# EasyEDA schematic 1-Schematic_task10.1_PCB.json
TITLE: Sheet_1; REV: 1.0; Date: 2021-05-09; Sheet: 1/1; Drawn By: nawaf329; Company: Your Company
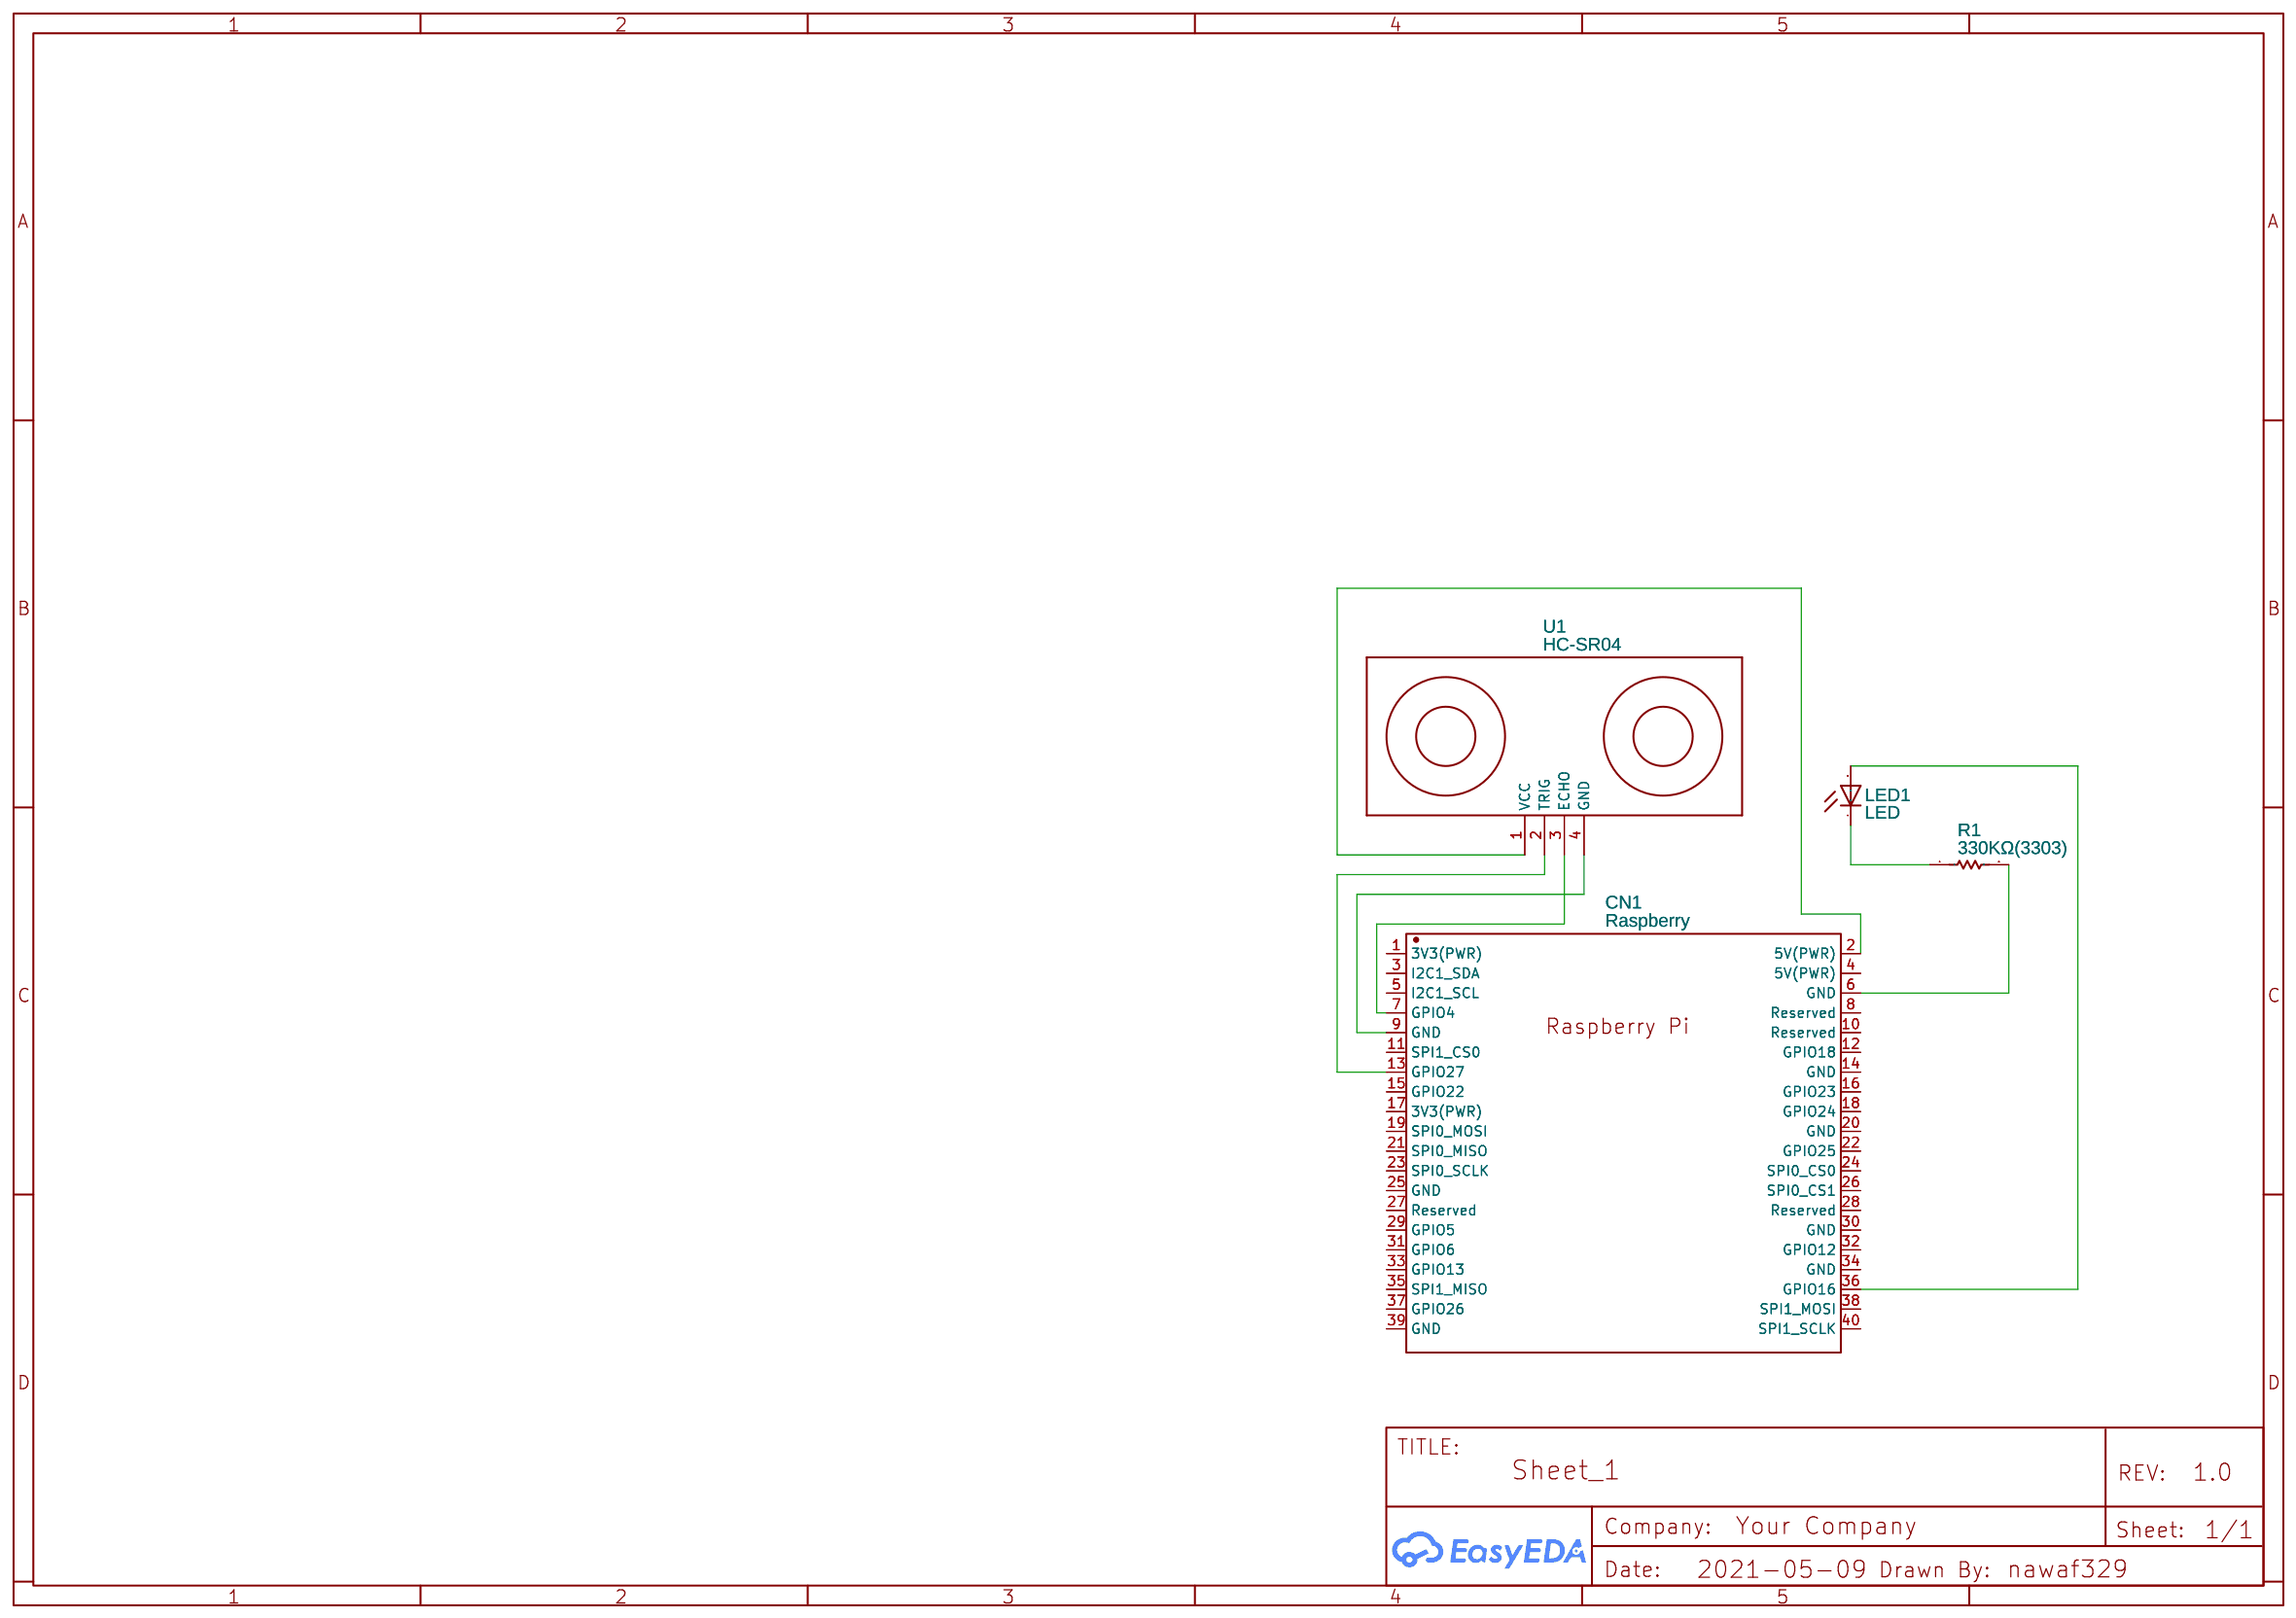
[diagram p0: schematic sheet]

## Parts
CN1  Raspberry  [HDR2X20-REVERSED]
LED1  LED  [LED-5MM-90DEG]
R1  330KΩ(3303)  [0201]
U1  HC-SR04  [HC-SR04]

## Library data of the parts
CN1 = Raspberry Pi 2: Contributor: Jason+Pierce; sourceId: gQK2WevN5
LED1 = LED: Contributor: DangerousPrototype
R1 = 330KΩ(3303): Supplier Part: undefined; Supplier: LCSC; Manufacturer: RTT013303FTH; Manufacturer Part: RALEC
U1 = HC-SR04: Ultrasonic Ranging Module HC-SR04; Contributor: h6000p

## Nets
Net-(CN1-2): CN1.2(5V(PWR)) U1.1(VCC)
Net-(CN1-6): CN1.6(GND) R1.2
Net-(CN1-7): CN1.7(GPIO4) U1.3(ECHO)
Net-(CN1-9): CN1.9(GND) U1.4(GND)
Net-(CN1-13): CN1.13(GPIO27) U1.2(TRIG)
Net-(CN1-36): CN1.36(GPIO16) LED1.A
Net-(LED1-K): LED1.K(C) R1.1

Not connected (* = marked no-connect by the designer): CN1 1(3V3(PWR)) 3(I2C1 SDA) 4(5V(PWR)) 5(I2C1 SCL) 8(Reserved) 10(Reserved) 11(SPI1 CS0) 12(GPIO18) 14(GND) 15(GPIO22) 16(GPIO23) 17(3V3(PWR)) 18(GPIO24) 19(SPI0 MOSI) 20(GND) 21(SPI0 MISO) 22(GPIO25) 23(SPI0 SCLK) 24(SPI0 CS0) 25(GND) 26(SPI0 CS1) 27(Reserved) 28(Reserved) 29(GPIO5) 30(GND) 31(GPIO6) 32(GPIO12) 33(GPIO13) 34(GND) 35(SPI1 MISO) 37(GPIO26) 38(SPI1 MOSI) 39(GND) 40(SPI1 SCLK)
